# EAGLE design ADS1299_4_Feather (EAGLE 9.6.2)
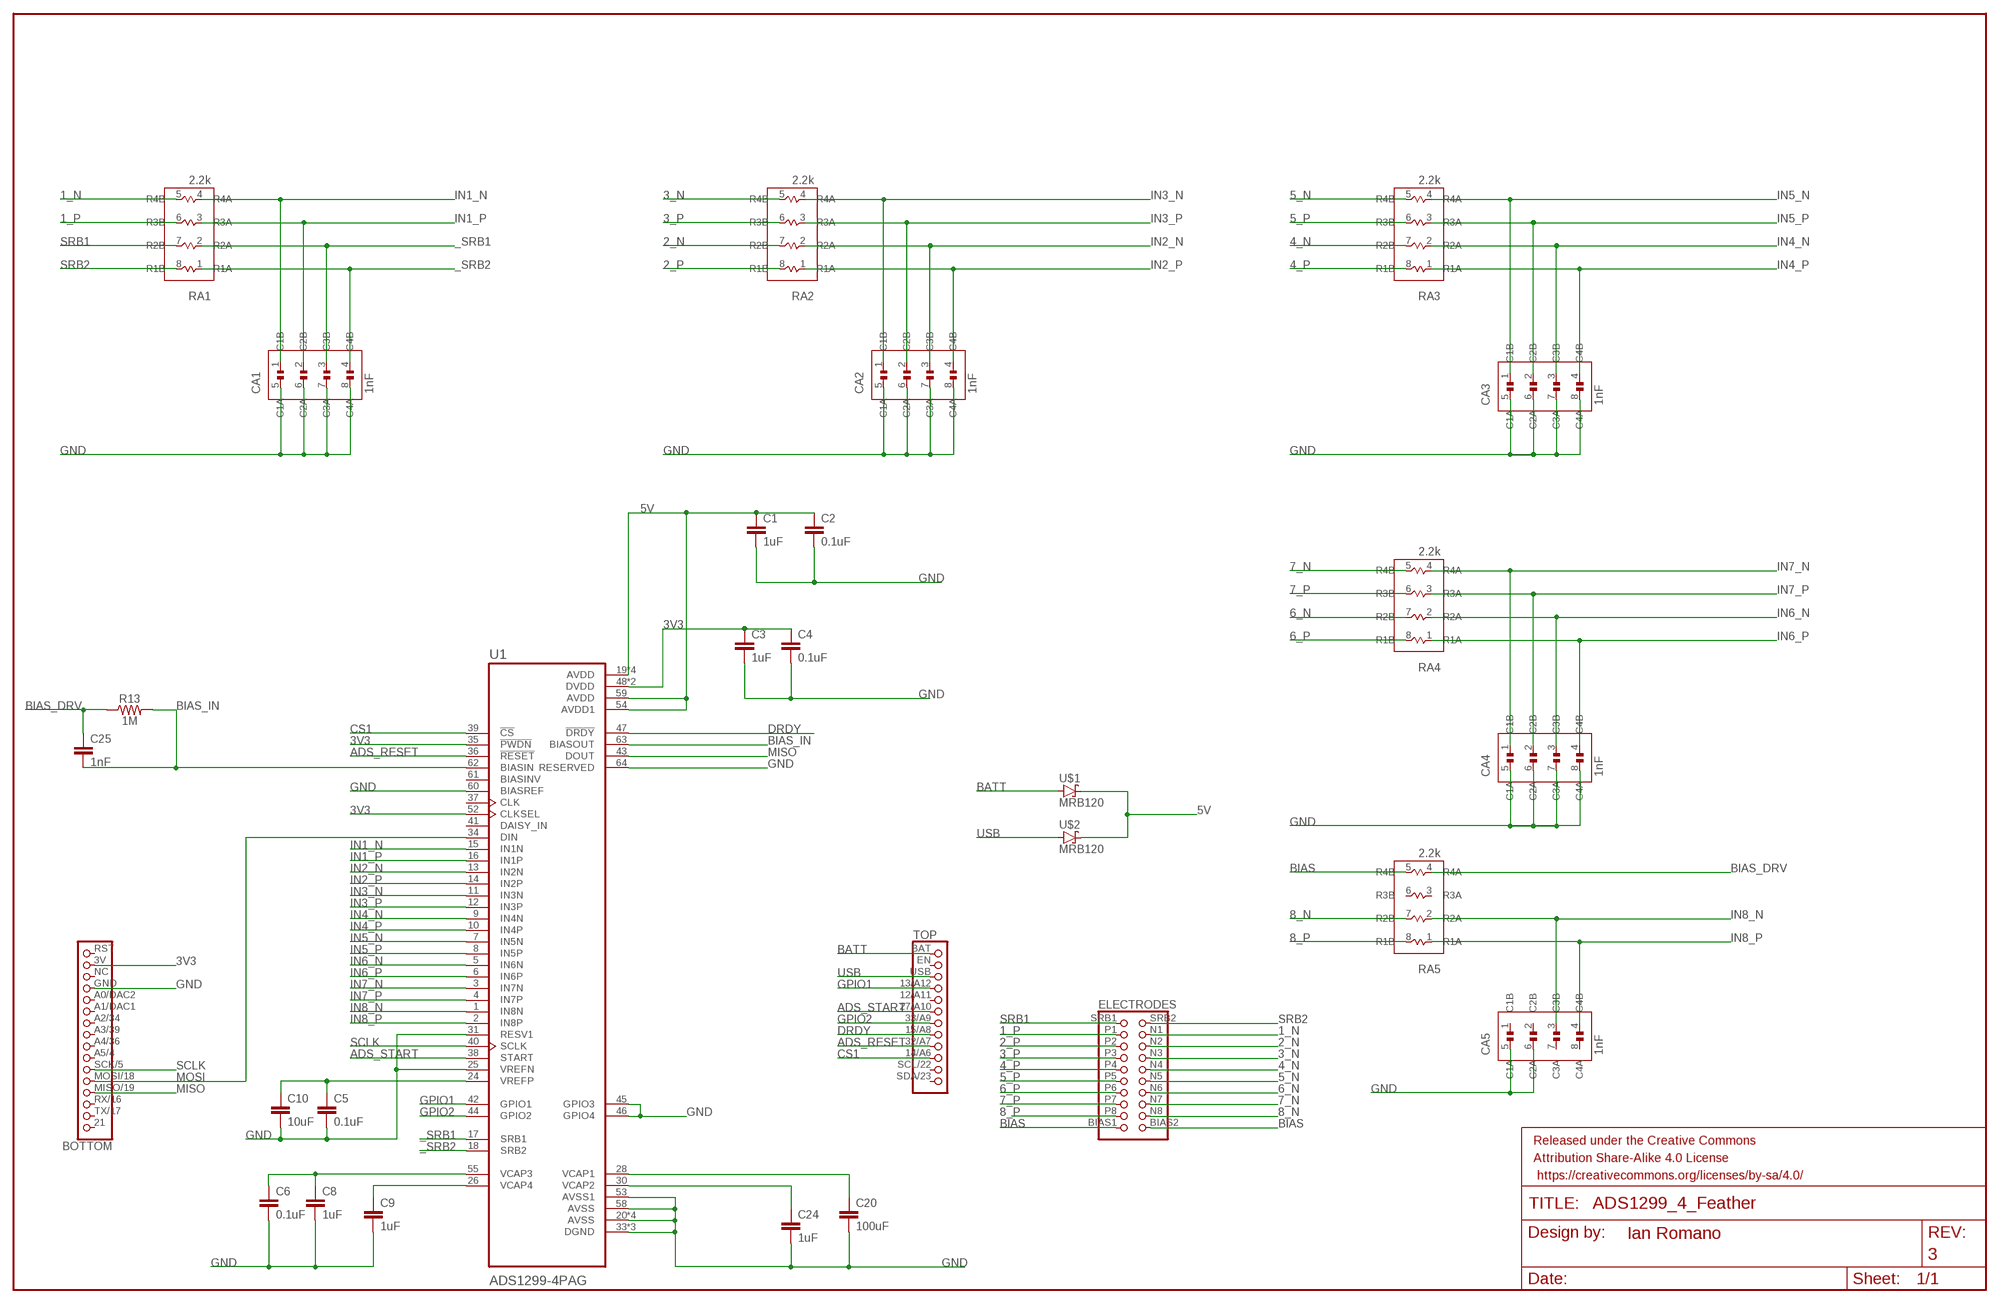
[diagram p0: schematic, sheet 1]

## Parts
BOTTOM  MICROBUILDER_HEADER-1X16_76MIL  [MICROBUILDER_1X16_ROUND_76MIL]
C1  1uF  10UF-0805-10V-10%  [0805]
C2  0.1uF  10UF-0805-10V-10%  [0805]
C3  1uF  10UF-0805-10V-10%  [0805]
C4  0.1uF  10UF-0805-10V-10%  [0805]
C5  0.1uF  10UF-0805-10V-10%  [0805]
C6  0.1uF  10UF-0805-10V-10%  [0805]
C8  1uF  10UF-0805-10V-10%  [0805]
C9  1uF  10UF-0805-10V-10%  [0805]
C10  10uF  10UF-0805-10V-10%  [0805]
C20  100uF  10UF-0805-10V-10%  [0805]
C24  1uF  10UF-0805-10V-10%  [0805]
C25  1nF  10UF-0805-10V-10%  [0805]
CA1  1nF  SLEEPSURELIB_W2A45C103MAT2A  [SLEEPSURELIB_CAPCAXE50P210X130X94-8N]
CA2  1nF  SLEEPSURELIB_W2A45C103MAT2A  [SLEEPSURELIB_CAPCAXE50P210X130X94-8N]
CA3  1nF  SLEEPSURELIB_W2A45C103MAT2A  [SLEEPSURELIB_CAPCAXE50P210X130X94-8N]
CA4  1nF  SLEEPSURELIB_W2A45C103MAT2A  [SLEEPSURELIB_CAPCAXE50P210X130X94-8N]
CA5  1nF  SLEEPSURELIB_W2A45C103MAT2A  [SLEEPSURELIB_CAPCAXE50P210X130X94-8N]
ELECTRODES  SLEEPSURELIB_PINHD-2X10-BIG  [SLEEPSURELIB_2X10-BIG]
FRAME1  FRAME-LEDGER  [CREATIVE_COMMONS]
R13  1M  RESISTOR0805  [0805]
RA1  2.2k  SLEEPSURELIB_EXB-28V222JX  [SLEEPSURELIB_RESCAXS50P200X100X45-8N]
RA2  2.2k  SLEEPSURELIB_EXB-28V222JX  [SLEEPSURELIB_RESCAXS50P200X100X45-8N]
RA3  2.2k  SLEEPSURELIB_EXB-28V222JX  [SLEEPSURELIB_RESCAXS50P200X100X45-8N]
RA4  2.2k  SLEEPSURELIB_EXB-28V222JX  [SLEEPSURELIB_RESCAXS50P200X100X45-8N]
RA5  2.2k  SLEEPSURELIB_EXB-28V222JX  [SLEEPSURELIB_RESCAXS50P200X100X45-8N]
TOP  MICROBUILDER_HEADER-1X1276MIL  [MICROBUILDER_1X12_ROUND_76MIL]
U1  ADS1299-4PAG  [QFP50P1200X1200X120-64N]
U$1  MRB120  MBR160HW  [SOD123FL]
U$2  MRB120  MBR160HW  [SOD123FL]

## Nets
1_N [DiffPairs]: ELECTRODES.N1 RA1.5(R4B)
1_P [DiffPairs]: ELECTRODES.P1 RA1.6(R3B)
2_N [DiffPairs]: ELECTRODES.N2 RA2.7(R2B)
2_P [DiffPairs]: ELECTRODES.P2 RA2.8(R1B)
3_N [DiffPairs]: ELECTRODES.N3 RA2.5(R4B)
3_P [DiffPairs]: ELECTRODES.P3 RA2.6(R3B)
3V3 [PWR]: BOTTOM.3V C3.1 C4.1 U1.35(!PWDN) U1.48(DVDD) U1.50(DVDD) U1.52(CLKSEL)
4_N [DiffPairs]: ELECTRODES.N4 RA3.7(R2B)
4_P [DiffPairs]: ELECTRODES.P4 RA3.8(R1B)
5_N: ELECTRODES.N5 RA3.5(R4B)
5_P: ELECTRODES.P5 RA3.6(R3B)
5V [PWR]: C1.1 C2.1 U1.19(AVDD) U1.21(AVDD) U1.22(AVDD) U1.54(AVDD1) U1.56(AVDD) U1.59(AVDD) U$1.C U$2.C
6_N: ELECTRODES.N6 RA4.7(R2B)
6_P: ELECTRODES.P6 RA4.8(R1B)
7_N: ELECTRODES.N7 RA4.5(R4B)
7_P: ELECTRODES.P7 RA4.6(R3B)
8_N: ELECTRODES.N8 RA5.7(R2B)
8_P: ELECTRODES.P8 RA5.8(R1B)
_SRB1: CA1.3(C3B) RA1.2(R2A) U1.17(SRB1)
_SRB2: CA1.4(C4B) RA1.1(R1A) U1.18(SRB2)
ADS_RESET: TOP.32/A7 U1.36(!RESET)
ADS_START: TOP.27/A10 U1.38(START)
BATT: TOP.BAT U$1.A
BIAS: ELECTRODES.BIAS1 ELECTRODES.BIAS2 RA5.5(R4B)
BIAS_DRV: C25.1 R13.1 RA5.4(R4A)
BIAS_IN: C25.2 R13.2 U1.62(BIASIN) U1.63(BIASOUT)
CS1: TOP.14/A6 U1.39(!CS)
DRDY: TOP.15/A8 U1.47(!DRDY)
GND [PWR]: BOTTOM.GND C1.2 C2.2 C3.2 C4.2 C5.2 C6.2 C8.2 C9.2 C10.2 C20.2 C24.2 CA1.5(C1A) CA1.6(C2A) CA1.7(C3A) CA1.8(C4A) CA2.5(C1A) CA2.6(C2A) CA2.7(C3A) CA2.8(C4A) CA3.5(C1A) CA3.6(C2A) CA3.7(C3A) CA3.8(C4A) CA4.5(C1A) CA4.6(C2A) CA4.7(C3A) CA4.8(C4A) CA5.5(C1A) CA5.6(C2A) U1.20(AVSS) U1.23(AVSS) U1.25(VREFN) U1.31(RESV1) U1.32(AVSS) U1.33(DGND) U1.45(GPIO3) U1.46(GPIO4) U1.49(DGND) U1.51(DGND) U1.53(AVSS1) U1.57(AVSS) U1.58(AVSS) U1.60(BIASREF) U1.64(RESERVED)
GPIO1: TOP.13/A12 U1.42(GPIO1)
GPIO2: TOP.33/A9 U1.44(GPIO2)
IN1_N [DiffPairs]: CA1.1(C1B) RA1.4(R4A) U1.15(IN1N)
IN1_P [DiffPairs]: CA1.2(C2B) RA1.3(R3A) U1.16(IN1P)
IN2_N [DiffPairs]: CA2.3(C3B) RA2.2(R2A) U1.13(IN2N)
IN2_P [DiffPairs]: CA2.4(C4B) RA2.1(R1A) U1.14(IN2P)
IN3_N [DiffPairs]: CA2.1(C1B) RA2.4(R4A) U1.11(IN3N)
IN3_P [DiffPairs]: CA2.2(C2B) RA2.3(R3A) U1.12(IN3P)
IN4_N [DiffPairs]: CA3.3(C3B) RA3.2(R2A) U1.9(IN4N)
IN4_P [DiffPairs]: CA3.4(C4B) RA3.1(R1A) U1.10(IN4P)
IN5_N: CA3.1(C1B) RA3.4(R4A) U1.7(IN5N)
IN5_P: CA3.2(C2B) RA3.3(R3A) U1.8(IN5P)
IN6_N: CA4.3(C3B) RA4.2(R2A) U1.5(IN6N)
IN6_P: CA4.4(C4B) RA4.1(R1A) U1.6(IN6P)
IN7_N: CA4.1(C1B) RA4.4(R4A) U1.3(IN7N)
IN7_P: CA4.2(C2B) RA4.3(R3A) U1.4(IN7P)
IN8_N: CA5.3(C3B) RA5.2(R2A) U1.1(IN8N)
IN8_P: CA5.4(C4B) RA5.1(R1A) U1.2(IN8P)
MISO: BOTTOM.MISO/19(MISO) U1.43(DOUT)
MOSI: BOTTOM.MOSI/18(MOSI) U1.34(DIN)
N$1: C5.1 C10.1 U1.24(VREFP)
N$3: C24.1 U1.30(VCAP2)
N$4: C6.1 C8.1 U1.55(VCAP3)
N$5: C20.1 U1.28(VCAP1)
N$6: C9.1 U1.26(VCAP4)
SCLK: BOTTOM.SCK/5(SCK) U1.40(SCLK)
SRB1: ELECTRODES.SRB1 RA1.7(R2B)
SRB2: ELECTRODES.SRB2 RA1.8(R1B)
USB: TOP.USB U$2.A
Unconnected: BOTTOM.21 BOTTOM.A0/DAC2(A0) BOTTOM.A1/DAC1(A1) BOTTOM.A2/34(A2) BOTTOM.A3/39(A3) BOTTOM.A4/36(A4) BOTTOM.A5/4(A5) BOTTOM.NC BOTTOM.RST BOTTOM.RX/16(RX) BOTTOM.TX/17(TX) CA5.1(C1B) CA5.2(C2B) CA5.7(C3A) CA5.8(C4A) RA5.3(R3A) RA5.6(R3B) TOP.12/A11 TOP.EN TOP.SCL/22(SCL) TOP.SDA/23(SDA) U1.37(CLK) U1.41(DAISY_IN) U1.61(BIASINV)

## Library data of the parts
BOTTOM = ADS_Feather:MICROBUILDER_HEADER-1X16: PIN HEADER
C1-C6 C8 C9 C20 C24 C25 = SparkFun-Capacitors:10UF: 10.0µF ceramic capacitors A capacitor is a passive two-terminal electrical component used to store electrical energy temporarily in an electric field.; PROD_ID: CAP-11330; VALUE: 10uF
C10 = SparkFun-Capacitors:10UF: 10.0µF ceramic capacitors A capacitor is a passive two-terminal electrical component used to store electrical energy temporarily in an electric field.; PROD_ID: CAP-11330
CA1-CA5 = ADS_Feather:SLEEPSURELIB_W2A45C103MAT2A: 4x 1nF Capacitor Array
ELECTRODES = ADS_Feather:SLEEPSURELIB_PINHD-2X10: PIN HEADER With larger annulars
FRAME1 = SparkFun-Aesthetics:FRAME-LEDGER: Schematic Frame - Ledger Standard 11x14 US Ledger frame; DESIGNER: Ian Romano; REV: 3
R13 = SparkFun-Resistors:RESISTOR: Generic Resistor Package
RA1-RA5 = ADS_Feather:SLEEPSURELIB_EXB-28V222JX: 2.2k 4x Resistor Array
TOP = ADS_Feather:MICROBUILDER_HEADER-1X12
U1 = ADS1299-4PAG:ADS1299-4PAG: Check prices <https://pricing.snapeda.com/search/part/ADS1299-4PAG/?ref=eda>; AVAILABILITY: Warning; DESCRIPTION: Low-Noise, 4-Channel, 24-Bit Analog-to-Digital Converter for Biopotential Measurements 64-TQFP -40 to 85; MF: Texas Instruments; MP: ADS1299-4PAG; PACKAGE: TQFP-64 Texas Instruments; PRICE: None; PURCHASE-URL: https://pricing.snapeda.com/search/part/ADS1299-4PAG/?ref=eda
U$1 U$2 = ADS_Feather:MBR160HW: MBR160HW SCHOTTKY BARRIER DIODE Based on SMC MBR160HW SCHOTTKY BARRIER DIODE: datasheet <http://www.smc-diodes.com/propdf/MBR160HW%20N0933%20REV.B.pdf>.

## Net classes
0 default: width 0.152 mm, drill 0.305 mm, clearance 0.152 mm
1 DiffPairs: width 0.152 mm, drill 0.305 mm, clearance 0.152 mm
2 PWR: width 0.203 mm, drill 0.305 mm, clearance 0.203 mm

## Board
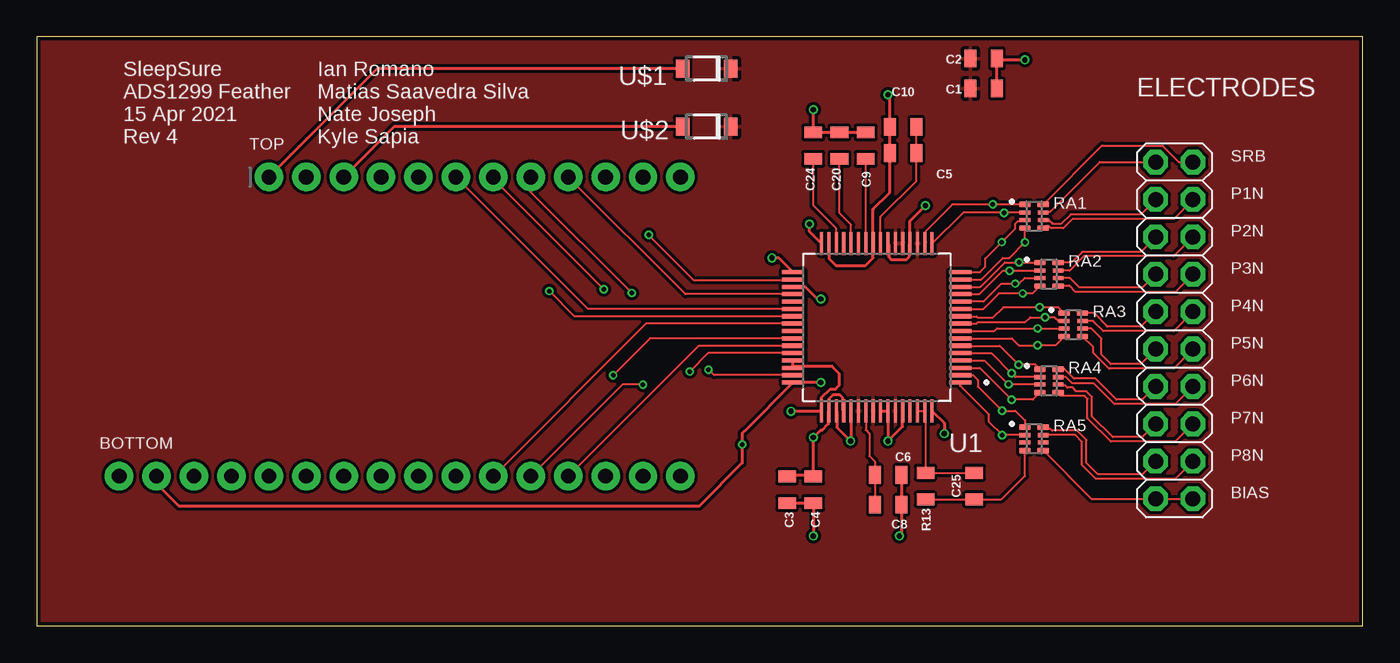
[diagram p1: board, top side]
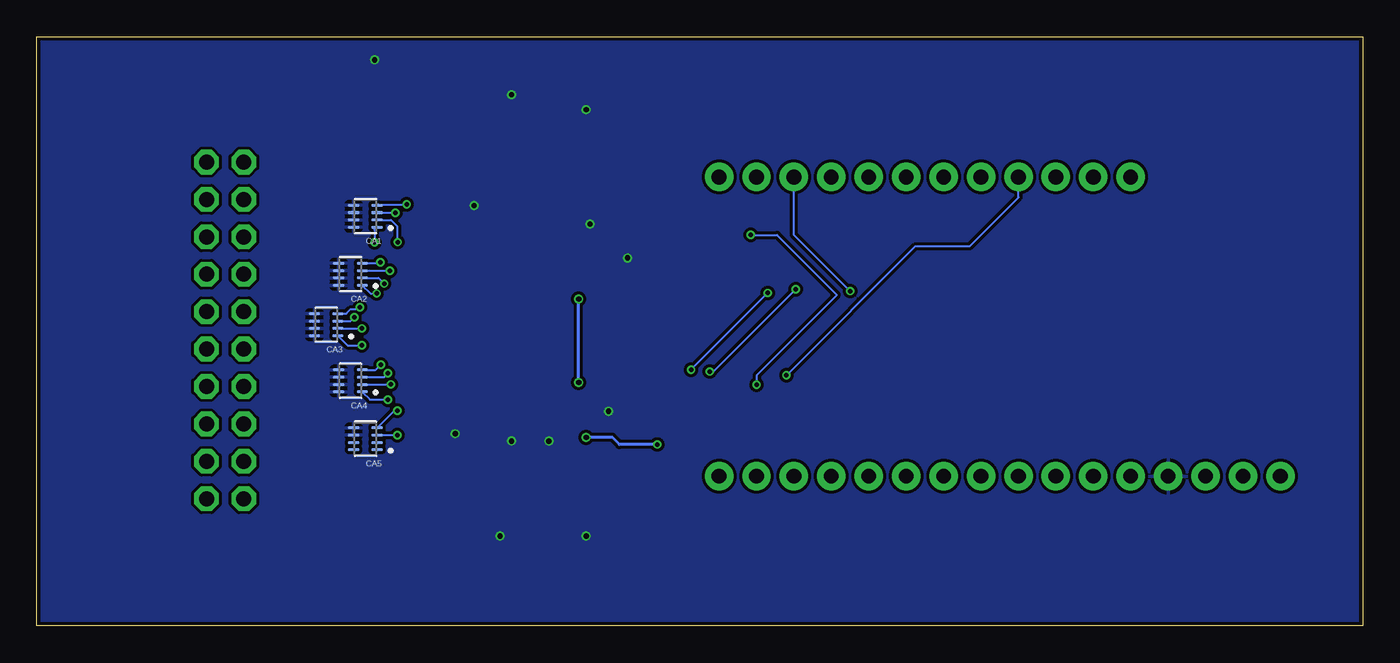
[diagram p2: board, bottom side, seen from below]

Size 90 x 40 mm. Coordinates in mm from the lower left corner, seen from the top.
Outline: 0,0 90,0 90,40 0,40 0,0
Copper layers (1*16): Top 0.035mm / dielectric 1.5mm / Bottom 0.035mm
Design rules "jplpcb_4layer *": minimum track width 5mil, minimum drill 0.2mm, track to track 5mil, track to pad 0.2mm, pad to pad 5mil, via to via 5mil, smd to smd 0mil, copper to edge 10mil, drill to drill 8mil, minimum pad ring 0.13mm, minimum via ring 0.13mm, stop-mask expansion 0.00126875mm, vias tented up to drill 20mil, thermal gap 10mil

### Footprints (pad centres in the part's own frame; a part is rotated, then mirrored left to right if it is on the bottom)
MICROBUILDER_1X16_ROUND_76MIL = drill 1 pad 1.93: 3V -16.51,0; 21 19.05,0; A0/DAC2 -8.89,0; A1/DAC1 -6.35,0; A2/34 -3.81,0; A3/39 -1.27,0; A4/36 1.27,0; A5/4 3.81,0; GND -11.43,0; MISO/19 11.43,0; MOSI/18 8.89,0; NC -13.97,0; RST -19.05,0; RX/16 13.97,0; SCK/5 6.35,0; TX/17 16.51,0
0805 = smd 0.8 x 1.2: 1 -0.9,0; 2 0.9,0
SLEEPSURELIB_CAPCAXE50P210X130X94-8N = smd 0.77 x 0.21: 1 -0.8,0.75; 2 -0.8,0.25; 3 -0.8,-0.25; 4 -0.8,-0.75; 5 0.8,-0.75; 6 0.8,-0.25; 7 0.8,0.25; 8 0.8,0.75
SLEEPSURELIB_2X10-BIG = drill 1.016 pad 1.676 octagon: BIAS1 12.7,-1.27; BIAS2 12.7,1.27; N1 -7.62,1.27; N2 -5.08,1.27; N3 -2.54,1.27; N4 0,1.27; N5 2.54,1.27; N6 5.08,1.27; N7 7.62,1.27; N8 10.16,1.27; P1 -7.62,-1.27; P2 -5.08,-1.27; P3 -2.54,-1.27; P4 0,-1.27; P5 2.54,-1.27; P6 5.08,-1.27; P7 7.62,-1.27; P8 10.16,-1.27; SRB1 -10.16,-1.27; SRB2 -10.16,1.27
SLEEPSURELIB_RESCAXS50P200X100X45-8N = smd 0.79 x 0.39: 1 -0.62,0.8; 4 -0.62,-0.8; 5 0.62,-0.8; 8 0.62,0.8 | smd 0.79 x 0.29: 2 -0.62,0.25; 3 -0.62,-0.25; 6 0.62,-0.25; 7 0.62,0.25
MICROBUILDER_1X12_ROUND_76MIL = drill 1 pad 1.93: 12/A11 -3.81,0; 13/A12 -6.35,0; 14/A6 8.89,0; 15/A8 3.81,0; 27/A10 -1.27,0; 32/A7 6.35,0; 33/A9 1.27,0; BAT -13.97,0; EN -11.43,0; SCL/22 11.43,0; SDA/23 13.97,0; USB -8.89,0
QFP50P1200X1200X120-64N = smd 1.56 x 0.28: 1 -5.68,3.75; 2 -5.68,3.25; 3 -5.68,2.75; 4 -5.68,2.25; 5 -5.68,1.75; 6 -5.68,1.25; 7 -5.68,0.75; 8 -5.68,0.25; 9 -5.68,-0.25; 10 -5.68,-0.75; 11 -5.68,-1.25; 12 -5.68,-1.75; 13 -5.68,-2.25; 14 -5.68,-2.75; 15 -5.68,-3.25; 16 -5.68,-3.75; 33 5.68,-3.75; 34 5.68,-3.25; 35 5.68,-2.75; 36 5.68,-2.25; 37 5.68,-1.75; 38 5.68,-1.25; 39 5.68,-0.75; 40 5.68,-0.25; 41 5.68,0.25; 42 5.68,0.75; 43 5.68,1.25; 44 5.68,1.75; 45 5.68,2.25; 46 5.68,2.75; 47 5.68,3.25; 48 5.68,3.75 | smd 0.28 x 1.56: 17 -3.75,-5.68; 18 -3.25,-5.68; 19 -2.75,-5.68; 20 -2.25,-5.68; 21 -1.75,-5.68; 22 -1.25,-5.68; 23 -0.75,-5.68; 24 -0.25,-5.68; 25 0.25,-5.68; 26 0.75,-5.68; 27 1.25,-5.68; 28 1.75,-5.68; 29 2.25,-5.68; 30 2.75,-5.68; 31 3.25,-5.68; 32 3.75,-5.68; 49 3.75,5.68; 50 3.25,5.68; 51 2.75,5.68; 52 2.25,5.68; 53 1.75,5.68; 54 1.25,5.68; 55 0.75,5.68; 56 0.25,5.68; 57 -0.25,5.68; 58 -0.75,5.68; 59 -1.25,5.68; 60 -1.75,5.68; 61 -2.25,5.68; 62 -2.75,5.68; 63 -3.25,5.68; 64 -3.75,5.68
SOD123FL = smd 0.91 x 1.22: A 1.625,0; C -1.625,0

### Placement (x,y rotation side)
BOTTOM  24.64,10.16 0 top
C1  64.27,36.49 0 top
C2  64.27,38.53 0 top
C3  50.93,9.24 270 top
C4  52.7,9.24 270 top
C5  58.8,32.1 180 top
C6  57.78,10.26 0 top
C8  57.78,8.22 0 top
C9  56.26,32.61 90 top
C10  58.8,33.88 180 top
C20  54.48,32.61 90 top
C24  52.7,32.61 90 top
C25  63.63,9.49 90 top
CA1  67.69,27.81 180 bottom
CA2  68.71,23.88 180 bottom
CA3  70.36,20.45 180 bottom
CA4  68.71,16.64 180 bottom
CA5  67.69,12.7 180 bottom
ELECTRODES  77.22,21.34 270 top
FRAME1  0.14,50.3 0 top  (outside the outline)
R13  60.33,9.49 90 top
RA1  67.69,27.81 0 top
RA2  68.71,23.88 0 top
RA3  70.36,20.45 0 top
RA4  68.71,16.64 0 top
RA5  67.69,12.7 0 top
TOP  29.72,30.48 0 top
U1  57.02,20.27 180 top
U$1  45.47,37.85 180 top
U$2  45.47,33.91 180 top

### Tracks (layer width: path | path; a pad name or v marks a point on that pad's centre or on a via)
1_N
  Top 0.152: ELECTRODES.N1 77.17,27.64 70.31,27.64 69.85,27.18 | 69.85,27.18 | 69.85,27.18 69.67,27 68.84,27 68.7,27.14 68.45,27.14 68.45,27.05 68.42,27.01 RA1.5
1_P
  Top 0.152: ELECTRODES.P1 74.93,27.94 70.18,27.94 69.55,27.3 68.97,27.3 68.71,27.56 RA1.6 68.23,27.48
2_N
  Top 0.152: ELECTRODES.N2 77.17,25.09 71.09,25.09 70.12,24.13 RA2.7
2_P
  Top 0.152: ELECTRODES.P2 74.93,25.4 70.96,25.4 70.24,24.68 RA2.8
3_N
  Top 0.152: ELECTRODES.N3 77.29,22.68 70.5,22.68 70.08,23.11 70.04,23.08 RA2.5
3_P
  Top 0.152: ELECTRODES.P3 75.06,22.99 70.76,22.99 70.12,23.63 RA2.6
3V3  (via drill 0.3, 0.35)
  Top 0.203: v53.21,16.52 U1.48 48.03,13.21 48.01,13.21 47.88,13.08 v47.88,12.32 47.88,11.05 44.96,8.13 9.65,8.13 8.13,9.65 BOTTOM.3V | U1.52 54.72,14.64 54.72,15.48 54.52,15.68 54.03,15.68 53.77,15.42 U1.50 53.72,14.54 53.72,13.7 53.32,13.3 53.21,13.3 v52.7,12.8 52.7,10.26 | v53.21,22.19 53,22.19 52.17,23.02 U1.35 | C4.1 52.7,10.26 | C3.1 51.04,10.26 52.7,10.26
  Bottom 0.203: v52.7,12.8 50.93,12.8 50.45,12.32 v47.88,12.32 | v53.21,16.52 v53.21,22.19
4_N
  Top 0.152: ELECTRODES.N4 77.17,20.02 72.39,20.02 71.7,20.71 71.69,20.7 RA3.7
4_P
  Top 0.152: ELECTRODES.P4 74.93,20.32 72.64,20.32 72.64,20.37 71.77,21.25 RA3.8
5_N
  Top 0.152: ELECTRODES.N5 77.17,17.48 72.77,17.48 71.7,18.54 71.7,18.92 RA3.5
5_P
  Top 0.152: ELECTRODES.P5 74.93,17.78 72.9,17.78 72.26,18.41 72.26,19.5 71.57,20.2 RA3.6
5V
  pour Top: -0.25,40.39 -0.25,-0.25 90.42,-0.25 90.42,40.39
6_N
  Top 0.152: ELECTRODES.N6 77.29,15.06 73.15,15.06 71.73,16.48 70.27,16.48 69.86,16.89 RA4.7
6_P
  Top 0.152: ELECTRODES.P6 75.06,15.37 73.28,15.37 71.86,16.78 70.41,16.78 69.75,17.44 RA4.8
7_N
  Top 0.152: ELECTRODES.N7 77.29,12.52 72.9,12.52 71.32,14.1 71.32,15.42 71.12,15.62 69.54,15.62 RA4.5
7_P
  Top 0.152: ELECTRODES.P7 75.06,12.83 73.03,12.83 71.63,14.22 71.63,15.54 71.25,15.93 70.56,15.93 70.31,16.18 69.94,16.18 69.81,16.31 69.41,16.31 RA4.6
8_N
  Top 0.152: ELECTRODES.N8 77.29,9.98 71.88,9.98 70.94,10.92 70.94,12.5 70.48,12.95 RA5.7
8_P
  Top 0.152: ELECTRODES.P8 75.06,10.29 72.01,10.29 71.25,11.05 71.25,12.62 70.61,13.26 68.91,13.26 68.8,13.37 68.44,13.37 RA5.8
_SRB1  (via drill 0.3)
  Top 0.152: U1.17 62.89,28.06 65.66,28.06 | RA1.2 65.66,28.06 | v65.66,28.05 65.66,28.06
  Bottom 0.152: CA1.3 65.67,28.06 v65.66,28.05
_SRB2  (via drill 0.3)
  Top 0.152: U1.18 60.36,26.03 60.36,26.82 62.15,28.61 v64.9,28.61 | RA1.1 v64.9,28.61 | v64.9,28.62 v64.9,28.61
  Bottom 0.152: CA1.4 66.83,28.62 v64.9,28.62
ADS_RESET
  Top 0.152: U1.36 44.03,22.52 TOP.32/A7
ADS_START
  Top 0.152: U1.38 37.41,21.52 TOP.27/A10
BATT
  Top 0.203: U$1.A 23.11,37.85 TOP.BAT
BIAS
  Top 0.152: RA5.5 71.58,8.64 ELECTRODES.BIAS1 ELECTRODES.BIAS2
BIAS_DRV
  Top 0.152: R13.1 C25.1 65.49,8.59 67.07,10.18 RA5.4
BIAS_IN
  Top 0.152: U1.62 U1.63 60.33,14.54 R13.2 C25.2
CS1  (via drill 0.3)
  Top 0.152: U1.39 36.51,21.02 v34.8,22.73
  Bottom 0.152: v34.8,22.73 38.61,26.54 TOP.14/A6
DRDY  (via drill 0.3)
  Top 0.152: U1.47 45.97,17.02 v45.59,17.4 | v40.39,22.61 33.53,29.46 TOP.15/A8
  Bottom 0.152: v45.59,17.4 v40.39,22.61
GND  (via drill 0.35)
  Top 0.203: U1.64 61.59,13.77 v61.59,13.05 | U1.57 U1.58 57.77,12.55 v57.78,12.54 58.77,13.53 U1.60 | U1.51 54.31,14.55 54.31,13.48 v55.24,12.54 55.27,12.57 U1.53 | U1.23 57.83,25.89 57.83,25.06 58.03,24.86 59.02,24.86 59.22,25.06 59.22,25.89 U1.20 59.27,27.49 v60.33,28.54 | U1.32 52.45,26.77 v52.45,27.27 | U1.33 50.38,24.99 v49.91,24.99 | v51.18,14.57 53.26,14.57 U1.49 53.27,15.49 53.86,16.08 54.21,16.08 54.48,16.35 54.48,17.11 53.98,17.62 51.34,17.62 U1.46 U1.45 | C6.2 C8.2 58.69,6.23 v58.55,6.1 | C3.2 C4.2 v52.7,6.1 | C9.2 C20.2 C24.2 v52.7,35.05 | C1.2 C2.2 65.27,38.43 v67.07,38.43 | U1.31 53.77,24.94 54.23,24.48 56.26,24.48 56.77,24.99 U1.25 56.77,28.29 57.9,29.42 C5.2 C10.2 57.9,35.95 v57.78,36.07
  pour Bottom: -0.51,40.64 -0.51,-0.51 90.93,-0.51 90.93,40.64
GPIO1  (via drill 0.3)
  Top 0.152: U1.42 41.62,19.52 v39.12,17.02
  Bottom 0.152: v39.12,17.02 30.35,25.78 26.67,25.78 23.37,29.08 TOP.13/A12
GPIO2  (via drill 0.3)
  Top 0.152: U1.44 45.57,18.52 v44.32,17.27 | v38.48,22.86 30.99,30.35 TOP.33/A9
  Bottom 0.152: v44.32,17.27 44.07,17.27 v38.48,22.86
IN1_N  (via drill 0.3)
  Top 0.152: RA1.4 v67.07,26.05 66,24.98 65.57,24.98 64.11,23.52 U1.15
  Bottom 0.152: CA1.1 67.07,26.88 v67.07,26.05
IN1_P  (via drill 0.3)
  Top 0.152: U1.16 64.03,24.02 64.39,24.38 64.39,24.94 v65.51,26.06 66.4,26.95 | 66.4,26.95 | 66.4,26.95 66.4,27.29 66.59,27.48 66.99,27.48 RA1.3
  Bottom 0.152: CA1.2 65.95,27.56 65.53,27.14 65.53,26.09 v65.51,26.06
IN2_N  (via drill 0.3)
  Top 0.152: U1.13 63.97,22.52 65.58,24.13 v66.04,24.13 | v66.04,24.13 RA2.2 | v66.04,24.12 v66.04,24.13
  Bottom 0.152: CA2.3 v66.05,24.13 v66.04,24.12
IN2_P  (via drill 0.3)
  Top 0.152: U1.14 64.04,23.02 65.7,24.68 v66.67,24.68 | v66.67,24.68 RA2.1 | v66.67,24.68
  Bottom 0.152: CA2.4 66.73,24.63 v66.67,24.68
IN3_N  (via drill 0.3)
  Top 0.152: U1.11 64.24,21.52 65.29,22.57 v66.93,22.57 67.58,22.57 RA2.4
  Bottom 0.152: CA2.1 67.35,22.57 v66.93,22.57
IN3_P  (via drill 0.3)
  Top 0.152: RA2.3 67.06,23.63 66.67,23.24 v66.42,23.24 65.48,23.24 64.26,22.02 U1.12
  Bottom 0.152: CA2.2 66.8,23.62 v66.42,23.24
IN4_N  (via drill 0.3)
  Top 0.152: U1.9 63.79,20.52 63.88,20.62 67.1,20.62 67.44,20.95 v68.45,20.95 69.08,20.95 69.34,20.7 RA3.2
  Bottom 0.152: CA3.3 68.71,20.7 v68.45,20.95
IN4_P  (via drill 0.3)
  Top 0.152: U1.10 63.79,21.02 63.88,20.92 64.9,20.92 65.6,21.63 v68.07,21.63 69.36,21.63 RA3.1
  Bottom 0.152: CA3.4 69,21.2 68.68,21.51 68.22,21.51 68.2,21.5 v68.07,21.63
IN5_N  (via drill 0.3)
  Top 0.152: U1.7 66.2,19.52 66.67,19.05 v67.94,19.05 69.14,19.05 RA3.4
  Bottom 0.152: CA3.1 68.91,19.05 v67.94,19.05
IN5_P  (via drill 0.3)
  Top 0.152: U1.8 65,20.02 65.17,20.2 v67.94,20.2 RA3.3
  Bottom 0.152: CA3.2 v67.94,20.2
IN6_N  (via drill 0.3)
  Top 0.152: U1.5 64.79,18.52 v66.17,17.14 66.42,16.89 RA4.2
  Bottom 0.152: CA4.3 66.42,16.89 v66.17,17.14
IN6_P  (via drill 0.3)
  Top 0.152: U1.6 65.36,19.02 v66.64,17.74 67.78,17.74 RA4.1
  Bottom 0.152: CA4.4 66.99,17.39 v66.64,17.74
IN7_N  (via drill 0.3)
  Top 0.152: U1.3 64.01,17.52 v66.17,15.37 67.62,15.37 RA4.4
  Bottom 0.152: CA4.1 67.39,15.37 v66.17,15.37
IN7_P  (via drill 0.3)
  Top 0.152: 65.96,16.39 64.33,18.02 U1.4 | RA4.3 65.96,16.39 | v65.96,16.4 65.96,16.39
  Bottom 0.152: CA4.2 65.97,16.39 v65.96,16.4
IN8_N  (via drill 0.3)
  Top 0.152: U1.1 62.7,16.27 62.73,16.27 64.64,14.35 64.64,13.84 v65.54,12.95 RA5.2
  Bottom 0.152: CA5.3 v65.54,12.95
IN8_P  (via drill 0.3)
  Top 0.152: U1.2 63.55,17.02 63.88,16.69 63.88,16.26 v65.53,14.61 66.42,14.61 67.07,13.96 RA5.1
  Bottom 0.152: v65.53,14.61 65.74,14.61 CA5.4
MISO
  Top 0.152: U1.43 44.93,19.02 BOTTOM.MISO/19
MOSI  (via drill 0.3)
  Top 0.152: U1.34 51.29,23.46 44.61,23.46 v41.53,26.54 | v41.15,16.38 39.75,16.38 BOTTOM.MOSI/18
  Bottom 0.152: v41.53,26.54 39.75,26.54 35.69,22.48 41.15,17.02 v41.15,16.38
N$1
  Top 0.152: U1.24 57.27,27.78 59.7,30.21 C5.1 C10.1
N$3
  Top 0.152: U1.30 54.27,26.98 52.7,28.54 C24.1
N$4
  Top 0.152: U1.55 56.27,13.29 56.52,13.05 56.52,11.53 56.88,11.16 C6.1 C8.1
N$5
  Top 0.152: U1.28 55.27,27.25 54.48,28.04 C20.1
N$6
  Top 0.152: U1.26 56.27,31.7 C9.1
SCLK
  Top 0.152: U1.40 41.35,20.52 BOTTOM.SCK/5
SRB1
  Top 0.152: RA1.7 68.39,28.14 68.79,28.14 72.15,31.5 ELECTRODES.SRB1
SRB2
  Top 0.152: ELECTRODES.SRB2 77.52,31.5 76.41,32.61 72.31,32.61 RA1.8
USB
  Top 0.203: U$2.A 24.26,33.91 TOP.USB

### Text on the board
tNames: SleepSure / ADS1299 Feather / 15 Apr 2021 / Rev 4 | Ian Romano / Matias Saavedra Silva / Nate Joseph / Kyle Sapia
200bmp: G:/downloads/struttinYD-blue.bmp